# EAGLE design eTapper1main54 (EAGLE 8.6.0)
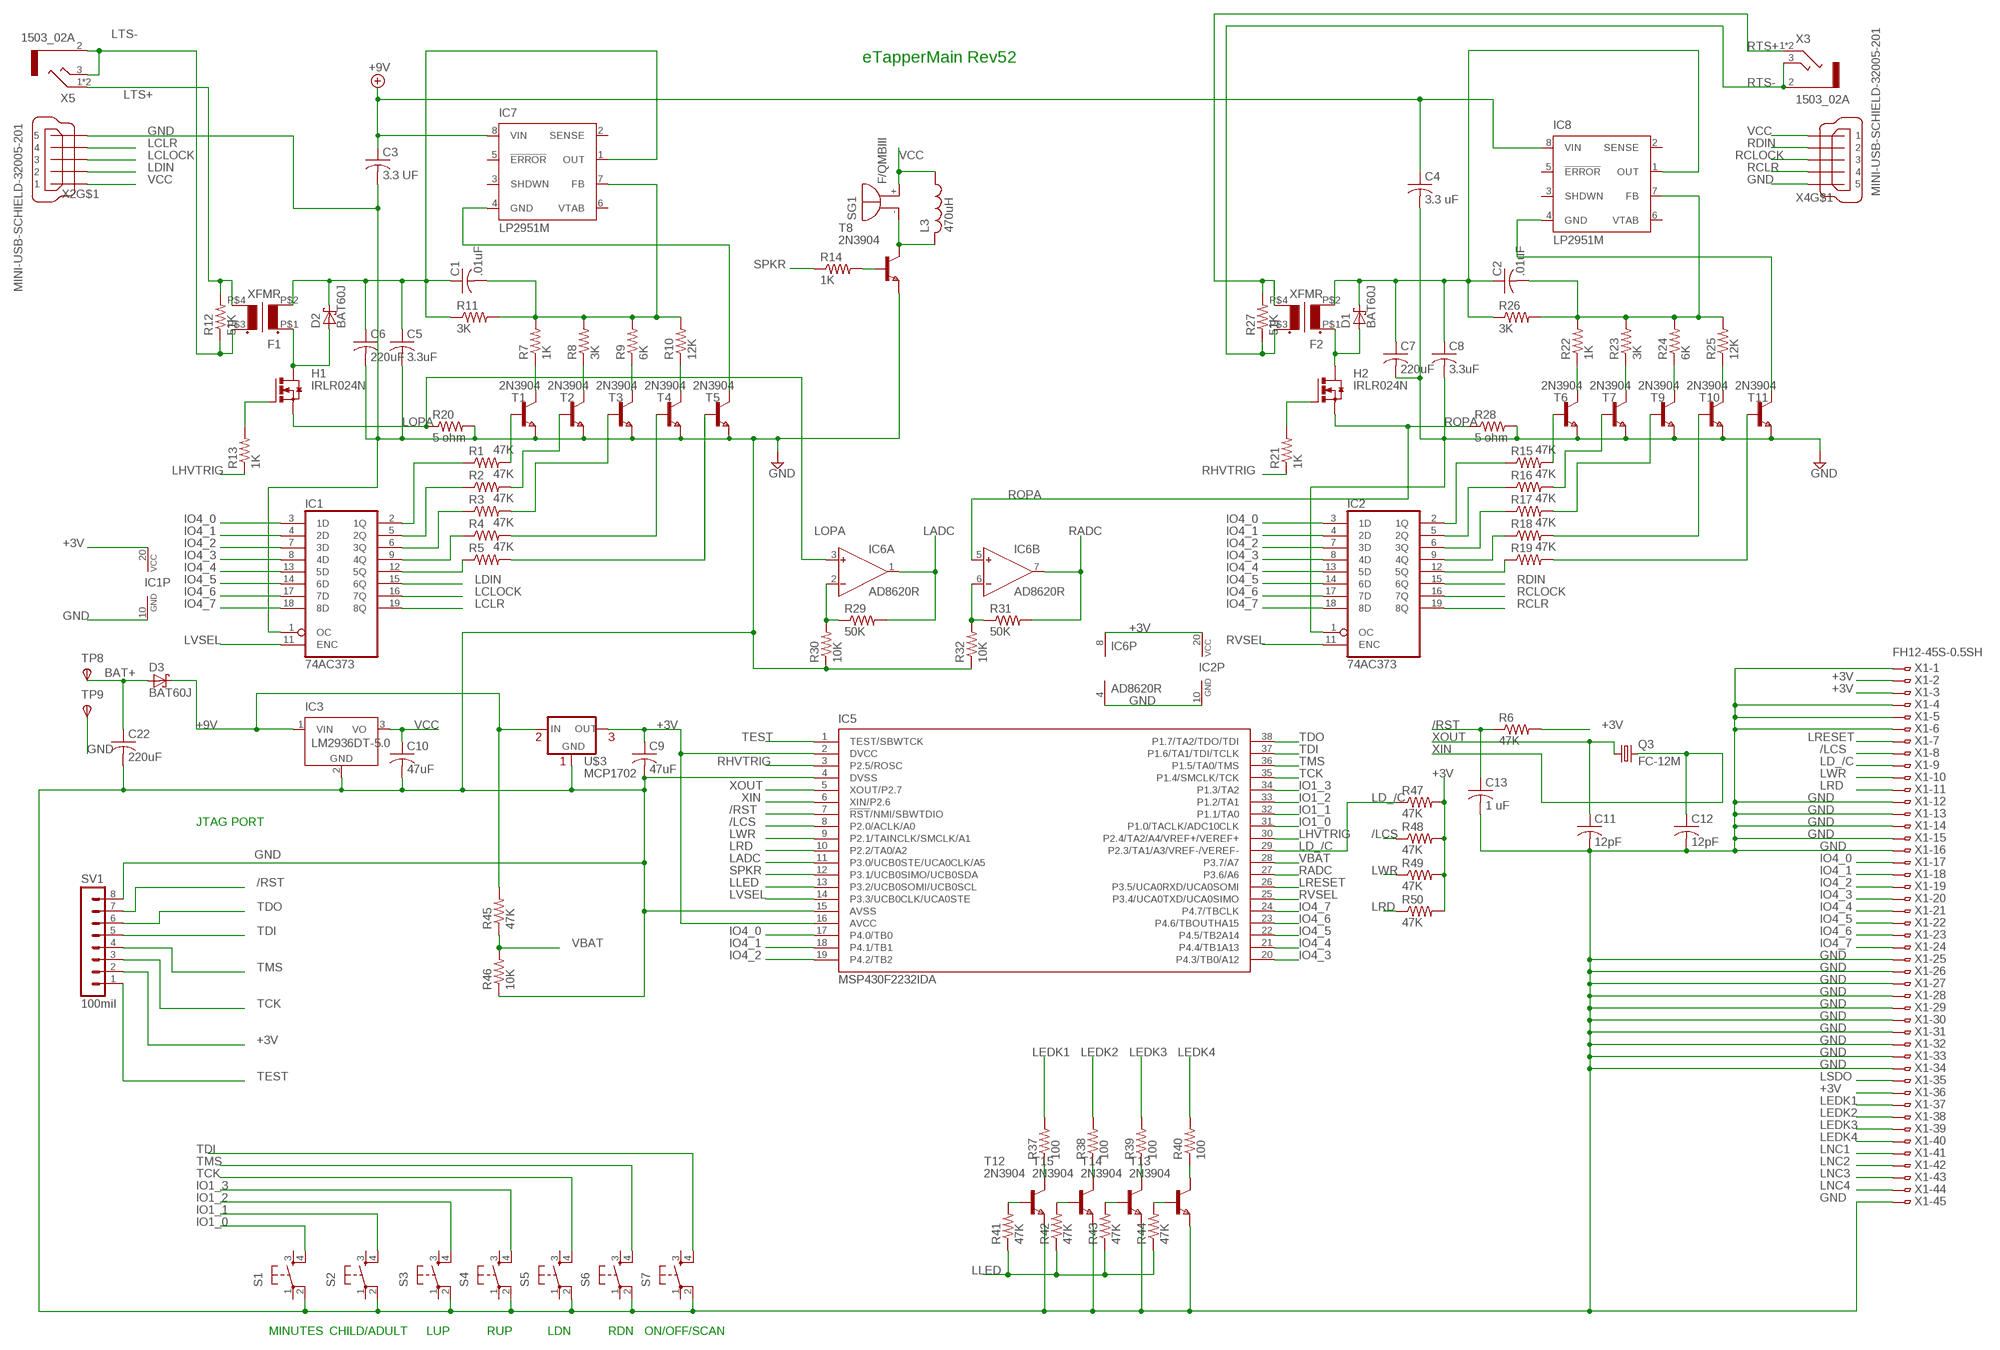
[diagram p0: schematic, sheet 1]

## Parts
C1  .01uF  C-USC0805  [C0805]
C2  .01uF  C-USC0805  [C0805]
C3  3.3 UF  C-USC1206  [C1206]
C4  3.3 uF  C-USC1206  [C1206]
C5  3.3uF  C-USC0805  [C0805]
C6  220uF  C-USC1206  [C1206]
C7  220uF  C-USC1206  [C1206]
C8  3.3uF  C-USC0805  [C0805]
C9  47uF  C-USC1206  [C1206]
C10  47uF  C-USC1206  [C1206]
C11  12pF  C-USC0805  [C0805]
C12  12pF  C-USC0805  [C0805]
C13  1 uF  C-USC0805  [C0805]
C22  220uF  C-USC1206  [C1206]
D1  BAT60J  [SOD323_ST]
D2  BAT60J  [SOD323_ST]
D3  BAT60J  [SOD323_ST]
F1  XFMR  [XFMR]
F2  XFMR  [XFMR]
H1  IRLR024N  [D-PAK_TO252AA]
H2  IRLR024N  [D-PAK_TO252AA]
IC1  74AC373  [SO20]
IC2  74AC373  [SO20]
IC3  LM2936DT-5.0  [TO252]
IC5  MSP430F2232IDA  [TSSOP38_R-PDSO-G38-DA]
IC6  AD8620R  [SO8]
IC7  LP2951M  [SO08]
IC8  LP2951M  [SO08]
L3  470uH  L-USL2825P  [L2825P]
Q3  FC-12M  [FC-12M]
R1  47K  R-US_R0603  [R0603]
R2  47K  R-US_R0603  [R0603]
R3  47K  R-US_R0603  [R0603]
R4  47K  R-US_R0603  [R0603]
R5  47K  R-US_R0603  [R0603]
R6  47K  R-US_R0603  [R0603]
R7  1K  R-US_R0603  [R0603]
R8  3K  R-US_R0603  [R0603]
R9  6K  R-US_R0603  [R0603]
R10  12K  R-US_R0603  [R0603]
R11  3K  R-US_R0603  [R0603]
R12  51K  R-US_R0603  [R0603]
R13  1K  R-US_R0603  [R0603]
R14  1K  R-US_R0603  [R0603]
R15  47K  R-US_R0603  [R0603]
R16  47K  R-US_R0603  [R0603]
R17  47K  R-US_R0603  [R0603]
R18  47K  R-US_R0603  [R0603]
R19  47K  R-US_R0603  [R0603]
R20  5 ohm  R-US_R0603  [R0603]
R21  1K  R-US_R0603  [R0603]
R22  1K  R-US_R0603  [R0603]
R23  3K  R-US_R0603  [R0603]
R24  6K  R-US_R0603  [R0603]
R25  12K  R-US_R0603  [R0603]
R26  3K  R-US_R0603  [R0603]
R27  51K  R-US_R0603  [R0603]
R28  5 ohm  R-US_R0603  [R0603]
R29  50K  R-US_R0603  [R0603]
R30  10K  R-US_R0603  [R0603]
R31  50K  R-US_R0603  [R0603]
R32  10K  R-US_R0603  [R0603]
R37  100  R-US_R0603  [R0603]
R38  100  R-US_R0603  [R0603]
R39  100  R-US_R0603  [R0603]
R40  100  R-US_R0603  [R0603]
R41  47K  R-US_R0603  [R0603]
R42  47K  R-US_R0603  [R0603]
R43  47K  R-US_R0603  [R0603]
R44  47K  R-US_R0603  [R0603]
R45  47K  R-US_R0603  [R0603]
R46  10K  R-US_R0603  [R0603]
R47  47K  R-US_R0603  [R0603]
R48  47K  R-US_R0603  [R0603]
R49  47K  R-US_R0603  [R0603]
R50  47K  R-US_R0603  [R0603]
S1  10-XX  [B3F-10XX]
S2  10-XX  [B3F-10XX]
S3  10-XX  [B3F-10XX]
S4  10-XX  [B3F-10XX]
S5  10-XX  [B3F-10XX]
S6  10-XX  [B3F-10XX]
S7  10-XX  [B3F-10XX]
SG1  F/QMBIII  [F/QMBIII]
SV1  100mil  MA08-1  [MA08-1]
T1  2N3904  NPNSOT23  [SOT-23]
T2  2N3904  NPNSOT23  [SOT-23]
T3  2N3904  NPNSOT23  [SOT-23]
T4  2N3904  NPNSOT23  [SOT-23]
T5  2N3904  NPNSOT23  [SOT-23]
T6  2N3904  NPNSOT23  [SOT-23]
T7  2N3904  NPNSOT23  [SOT-23]
T8  2N3904  NPNSOT23  [SOT-23]
T9  2N3904  NPNSOT23  [SOT-23]
T10  2N3904  NPNSOT23  [SOT-23]
T11  2N3904  NPNSOT23  [SOT-23]
T12  2N3904  NPNSOT23  [SOT-23]
T13  2N3904  NPNSOT23  [SOT-23]
T14  2N3904  NPNSOT23  [SOT-23]
T15  2N3904  NPNSOT23  [SOT-23]
TP8  TPSPAD1-20  [P1-20]
TP9  TPSPAD1-20  [P1-20]
U$3  MCP1702  [TO92-]
X1  FH12-45S-0.5SH  [FH12-45S-0.5SH]
X2  MINI-USB-SCHIELD-32005-201  [32005-201]
X3  1503_02A  [1503_02]
X4  MINI-USB-SCHIELD-32005-201  [32005-201]
X5  1503_02A  [1503_02]

## Nets
+3V [+3V]: C9.1 IC1.20(VCC) IC2.20(VCC) IC5.2(DVCC) IC5.16(AVCC) IC6.8(P:V+) R6.2 R47.2 R48.2 R49.2 R50.2 SV1.2 U$3.3(OUT) X1.2 X1.3 X1.36
+9V [+9V]: C3.1 C4.1 D3.C IC3.1(VIN) IC7.8(VIN) IC8.8(VIN) R45.2 U$3.2(IN)
/LCS: IC5.8(P2.0/ACLK/A0) R48.1 X1.8
/RST: C13.1 IC5.7(!RST!/NMI/SBWTDIO) R6.1 SV1.7
BAT+ [BAT+]: C22.1 D3.A TP8.TP(PP)
GND [GND]: C3.2 C4.2 C5.2 C6.2 C7.2 C8.2 C9.2 C10.2 C11.2 C12.2 C13.2 C22.2 IC1.1(OC) IC1.10(GND) IC2.1(OC) IC2.10(GND) IC3.2(GND) IC5.4(DVSS) IC5.15(AVSS) IC6.4(P:V-) R20.2 R28.2 R30.1 R32.1 R46.1 S1.2(P1) S2.2(P1) S3.2(P1) S4.2(P1) S5.2(P1) S6.2(P1) S7.2(P1) SV1.8 T1.2(E) T2.2(E) T3.2(E) T4.2(E) T5.2(E) T6.2(E) T7.2(E) T8.2(E) T9.2(E) T10.2(E) T11.2(E) T12.2(E) T13.2(E) T14.2(E) T15.2(E) TP9.TP(PP) U$3.1(GND) X1.1 X1.4 X1.5 X1.6 X1.12 X1.13 X1.14 X1.15 X1.16 X1.25 X1.26 X1.27 X1.28 X1.29 X1.30 X1.31 X1.32 X1.33 X1.34 X1.45 X2.5 X4.5
IO1_0: IC5.31(P1.0/TACLK/ADC10CLK) S1.4(S1)
IO1_1: IC5.32(P1.1/TA0) S2.4(S1)
IO1_2: IC5.33(P1.2/TA1) S3.4(S1)
IO1_3: IC5.34(P1.3/TA2) S4.4(S1)
IO4_0: IC1.3(1D) IC2.3(1D) IC5.17(P4.0/TB0) X1.17
IO4_1: IC1.4(2D) IC2.4(2D) IC5.18(P4.1/TB1) X1.18
IO4_2: IC1.7(3D) IC2.7(3D) IC5.19(P4.2/TB2) X1.19
IO4_3: IC1.8(4D) IC2.8(4D) IC5.20(P4.3/TB0/A12) X1.20
IO4_4: IC1.13(5D) IC2.13(5D) IC5.21(P4.4/TB1A13) X1.21
IO4_5: IC1.14(6D) IC2.14(6D) IC5.22(P4.5/TB2A14) X1.22
IO4_6: IC1.17(7D) IC2.17(7D) IC5.23(P4.6/TBOUTHA15) X1.23
IO4_7: IC1.18(8D) IC2.18(8D) IC5.24(P4.7/TBCLK) X1.24
LADC: IC5.11(P3.0/UCB0STE/UCA0CLK/A5) IC6.1(A:OUT) R29.2
LCLOCK: IC1.16(7Q) X2.3
LCLR: IC1.19(8Q) X2.4
LD_/C: IC5.29(P2.3/TA1/A3/VREF-/VEREF-) R47.1 X1.9
LDIN: IC1.15(6Q) X2.2
LEDK1: R37.2 X1.37
LEDK2: R38.2 X1.38
LEDK3: R39.2 X1.39
LEDK4: R40.2 X1.40
LHVTRIG: IC5.30(P2.4/TA2/A4/VREF+/VEREF+) R13.1
LLED: IC5.13(P3.2/UCB0SOMI/UCB0SCL) R41.1 R42.1 R43.1 R44.1
LNC1: X1.41
LNC2: X1.42
LNC3: X1.43
LNC4: X1.44
LOPA: H1.3(S) IC6.3(A:IN+) R20.1
LRD: IC5.10(P2.2/TA0/A2) R50.1 X1.11
LRESET: IC5.26(P3.5/UCA0RXD/UCA0SOMI) X1.7
LSDO: X1.35
LTS+: F1.P$4(S2) R12.2 X5.1 X5.4
LTS-: F1.P$3(S1) R12.1 X5.2 X5.3
LVSEL: IC1.11(ENC) IC5.14(P3.3/UCB0CLK/UCA0STE)
LWR: IC5.9(P2.1/TAINCLK/SMCLK/A1) R49.1 X1.10
N$1: IC1.2(1Q) R1.1
N$2: IC1.5(2Q) R2.1
N$3: IC1.6(3Q) R3.1
N$4: IC1.9(4Q) R4.1
N$5: IC1.12(5Q) R5.1
N$6: L3.2 SG1.-(+) T8.1(C)
N$7: R4.2 T4.3(B)
N$8: R5.2 T5.3(B)
N$9: D2.A F1.P$1(P1) H1.4(D)
N$10: R7.1 T1.1(C)
N$11: R8.1 T2.1(C)
N$12: R9.1 T3.1(C)
N$13: R1.2 T1.3(B)
N$14: R2.2 T2.3(B)
N$15: R3.2 T3.3(B)
N$16: R10.1 T4.1(C)
N$17: C1.2 IC7.7(FB) R7.2 R8.2 R9.2 R10.2 R11.2
N$18: C1.1 C5.1 C6.1 D2.C F1.P$2(P2) IC7.1(OUT) R11.1
N$19: D1.A F2.P$1(P1) H2.4(D)
N$20: IC2.2(1Q) R15.1
N$21: H1.1(G) R13.2
N$22: R14.2 T8.3(B)
N$24: IC2.5(2Q) R16.1
N$25: IC2.6(3Q) R17.1
N$26: IC2.9(4Q) R18.1
N$27: IC2.12(5Q) R19.1
N$28: R44.2 T13.3(B)
N$29: R15.2 T6.3(B)
N$30: R16.2 T7.3(B)
N$31: R17.2 T9.3(B)
N$32: R18.2 T10.3(B)
N$33: R19.2 T11.3(B)
N$35: R22.1 T6.1(C)
N$36: R23.1 T7.1(C)
N$37: R24.1 T9.1(C)
N$38: R25.1 T10.1(C)
N$39: C2.2 IC8.7(FB) R22.2 R23.2 R24.2 R25.2 R26.2
N$40: C2.1 C7.1 C8.1 D1.C F2.P$2(P2) IC8.1(OUT) R26.1
N$41: R37.1 T12.1(C)
N$42: H2.1(G) R21.2
N$43: R38.1 T15.1(C)
N$44: R39.1 T14.1(C)
N$45: IC7.4(GND) T5.1(C)
N$46: R40.1 T13.1(C)
N$47: IC8.4(GND) T11.1(C)
N$48: R43.2 T14.3(B)
N$49: R41.2 T12.3(B)
N$50: R42.2 T15.3(B)
N$52: IC6.6(B:IN-) R31.1 R32.2
N$54: IC6.2(A:IN-) R29.1 R30.2
RADC: IC5.27(P3.6/A6) IC6.7(B:OUT) R31.2
RCLOCK: IC2.16(7Q) X4.3
RCLR: IC2.19(8Q) X4.4
RDIN: IC2.15(6Q) X4.2
RHVTRIG: IC5.3(P2.5/ROSC) R21.1
ROPA: H2.3(S) IC6.5(B:IN+) R28.1
RTS+: F2.P$4(S2) R27.2 X3.1 X3.4
RTS-: F2.P$3(S1) R27.1 X3.2 X3.3
RVSEL: IC2.11(ENC) IC5.25(P3.4/UCA0TXD/UCA0SIMO)
SPKR: IC5.12(P3.1/UCB0SIMO/UCB0SDA) R14.1
TCK: IC5.35(P1.4/SMCLK/TCK) S5.4(S1) SV1.3
TDI: IC5.37(P1.6/TA1/TDI/TCLK) S7.4(S1) SV1.5
TDO: IC5.38(P1.7/TA2/TDO/TDI) SV1.6
TEST: IC5.1(TEST/SBWTCK) SV1.1
TMS: IC5.36(P1.5/TA0/TMS) S6.4(S1) SV1.4
VBAT: IC5.28(P3.7/A7) R45.1 R46.2
VCC [VCC]: C10.1 IC3.3(VO) L3.1 SG1.+(-) X2.1 X4.1
XIN: C12.1 IC5.6(XIN/P2.6) Q3.2
XOUT: C11.1 IC5.5(XOUT/P2.7) Q3.1
Unconnected: IC7.2(SENSE) IC7.3(SHDWN) IC7.5(!ERROR) IC7.6(VTAB) IC8.2(SENSE) IC8.3(SHDWN) IC8.5(!ERROR) IC8.6(VTAB) S1.1(P) S1.3(S) S2.1(P) S2.3(S) S3.1(P) S3.3(S) S4.1(P) S4.3(S) S5.1(P) S5.3(S) S6.1(P) S6.3(S) S7.1(P) S7.3(S) X2.M1(S:S1) X2.M2(S:S2) X2.M3(S:S3) X2.M4(S:S4) X4.M1(S:S1) X4.M2(S:S2) X4.M3(S:S3) X4.M4(S:S4)

## Notes on the sheet
- eTapperMain Rev52
- JTAG PORT
- MINUTES | CHILD/ADULT | LUP | RUP | LDN | RDN | ON/OFF/SCAN

## Library data of the parts
C1-C13 C22 = rcl:C-US: CAPACITOR, American symbol; SPICEPREFIX: C
D1-D3 = diode:BAT60J: Schottky barrier diode Source: www.st.com, BAT60J.pdf
F1 F2 = XFMR1:XFMR: Transformer 1"X1" 0.4"X0.4" hole separation for e_tapper
H1 H2 = IRLR024N:IRLR024N: IRLR024N HEXFET Power Mosfet N channel Infeneon Technology TO-251AA IPAK
IC1 IC2 = 74373_SO20:74*373: Octal D type transparent LATCH, edge triggered
IC3 = national-semiconductor:LM2936?*: Ultra-Low Quiescent Current LDO Voltage Regulator Source: Data sheet <http://www.national.com/ds/LM/LM2936.pdf>; MF: NATIONAL SEMICONDUCTOR; MPN: LM2936DT-5.0/NOPB; OC_FARNELL: 1286864; OC_NEWARK: 41K4501
IC5 = texas:MSP430F22*2IDA: MIXED SIGNAL MICROCONTROLLER Source: http://focus.ti.com/lit/ds/symlink/msp430f2274.pdf; MPN: MSP430F2232IDA; OC_FARNELL: 1610178; OC_NEWARK: 28M6312
IC6 = analog-devices:AD8620: Precision, Very Low Noise, Low Input Bias Current, Wide Bandwidth JFET Operational Amplifiers Source: http://www.analog.com/static/imported-files/data_sheets/AD8610_8620.pdf; MF: ALTERA CORPORATION; MPN: AD8620ARZ; OC_FARNELL: 9994386; OC_NEWARK: 59K6972
IC7 IC8 = national-semiconductor:LP2951: Adjustable Micropower Voltage Regulator Source: http://www.national.com/ds/LP/LP2950.pdf; MF: FAIRCHILD SEMICONDUCTOR; MPN: LP2951CM; OC_FARNELL: 9488561; OC_NEWARK: 78K6014
L3 = rcl:L-US: INDUCTOR, American symbol; SPICEPREFIX: L
Q3 = crystal:FC-12M: kHz RANGE CRYSTAL UNIT LOW PROFILE SMD Source: Epson Toyocom FC-12M.pdf
R1-R32 R37-R50 = resistor:R-US_: RESISTOR, American symbol
S1-S7 = switch-omron:10-XX: OMRON SWITCH; MPN: B3F-1000; OC_FARNELL: 176432; OC_NEWARK: 36M3542
SG1 = buzzer:F/QMBIII: BUZZER Source: Buerklin; OC_FARNELL: unknown; OC_NEWARK: unknown
SV1 = con-lstb:MA08-1: PIN HEADER; OC_FARNELL: unknown; OC_NEWARK: unknown
T1-T15 = zetex:NPNSOT23: NPN TRANSISTOR; MPN: DSS20201L-7; OC_FARNELL: 1710688; OC_NEWARK: 25R4555
TP8 TP9 = testpad:TPS: TEST PIN
U$3 = mcp1702:MCP1702: MCP1702 LDO Fixed Voltage regulator
X1 = con-hirose:FH12-45S-0.5S: 0.5mm Pitch Connectors For FPC/FFC Source: Data sheet <http://www.hirose.co.jp/cataloge_hp/e58605370.pdf>; OC_FARNELL: unknown; OC_NEWARK: unknown
X2 X4 = con-cypressindustries:MINI-USB-SCHIELD-: MINI USB-B Conector Source: www.cypressindustries.com; OC_FARNELL: unknown; OC_NEWARK: unknown
X3 X5 = 1503_02Astereojacks:1503_02A

## Module LP2951
Ports: 

### Library data of the parts

## Net classes
1 GND: width 0.305 mm, clearance 0.152 mm
2 BAT+: width 0.305 mm, clearance 0.152 mm
3 +9V: width 0.305 mm, clearance 0.152 mm
4 +3V: width 0.305 mm, clearance 0.152 mm
5 VCC: width 0.305 mm, clearance 0.152 mm

## Board
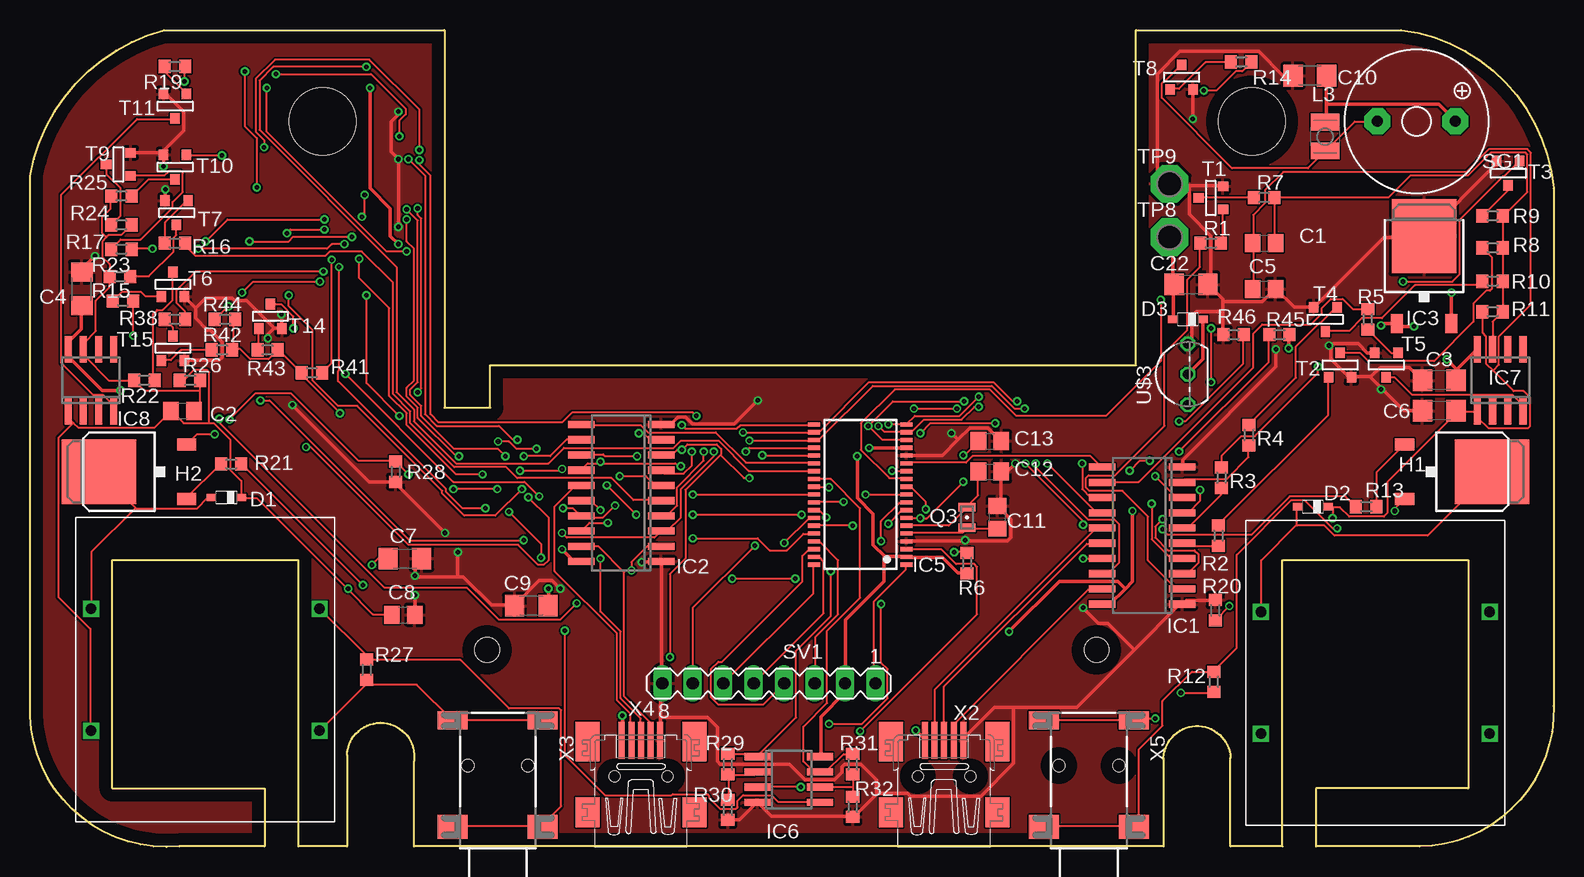
[diagram p1: board, top side]
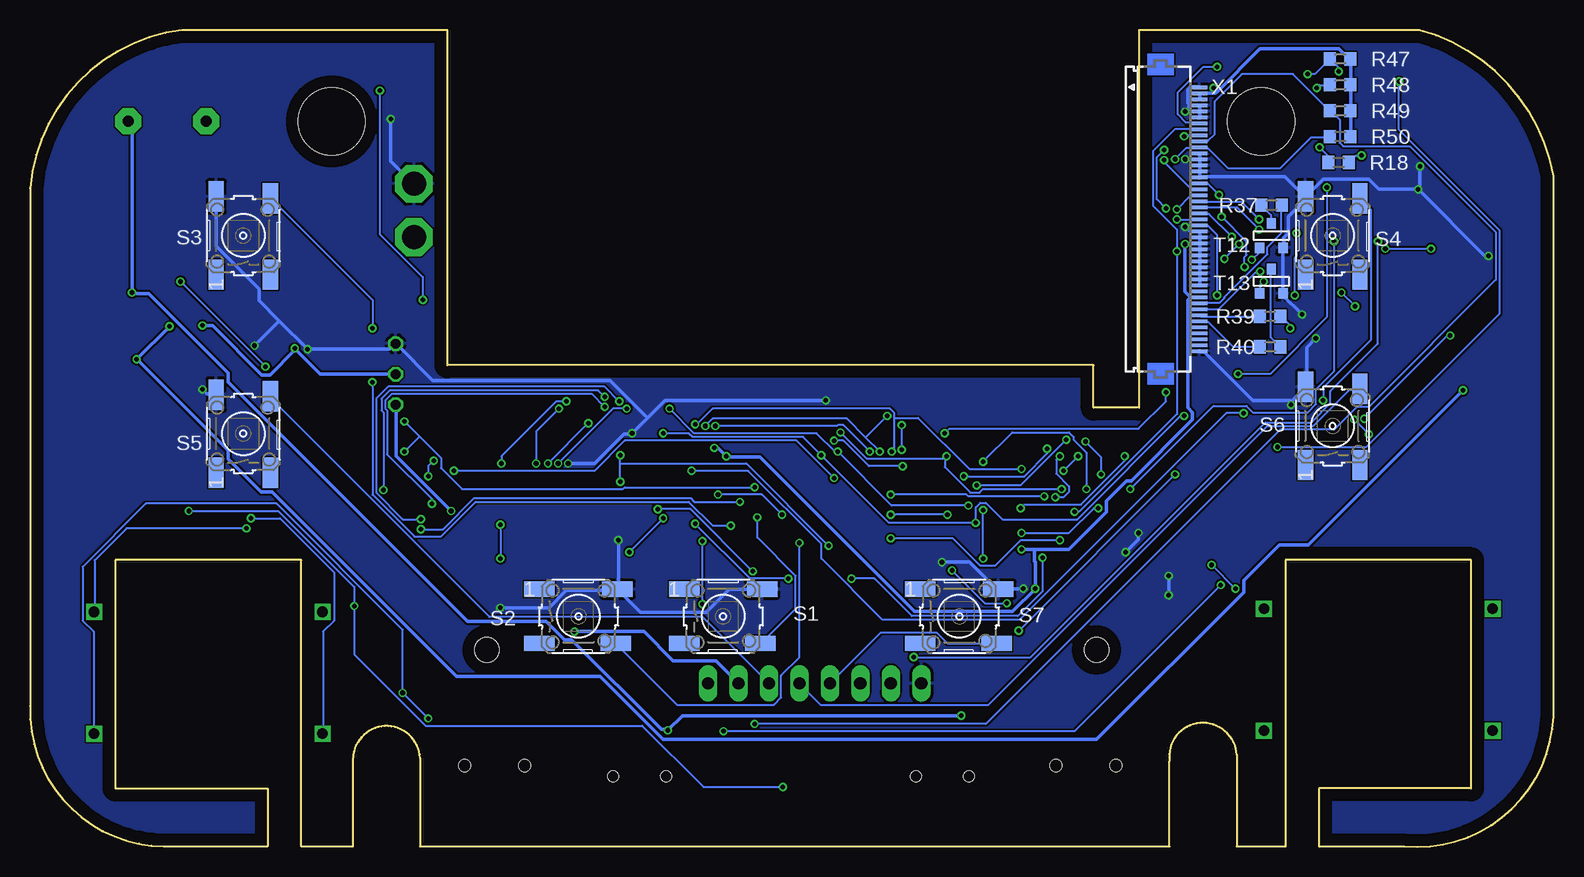
[diagram p2: board, bottom side, seen from below]

Size 127 x 68.12 mm. Coordinates in mm from the lower left corner, seen from the top.
Outline: 104.4,23.93 119.89,23.93 119.89,4.88 107.19,4.88 107.19,0.05 115.83,0.05 arc91 127,11.73 127,54.91 arc78 114.3,68.12 92.21,68.12 92.21,40.18 38.36,40.18 38.36,36.63 34.55,36.63 34.55,68.12 11.18,68.12 arc65 0,55.93 0,11.99 arc98 12.45,0.05 19.56,0.05 19.56,4.88 6.86,4.88 6.86,23.93 22.36,23.93 22.36,0.05 26.42,0.05 26.42,7.67 arc-185 32.01,7.16 32.01,0.05 94.49,0.05 94.49,7.42 arc-175 100.08,7.42 100.08,0.05 104.4,0.05 104.4,23.93
Copper layers (1*16): Top 0.035mm / dielectric 30mil / Bottom 0.035mm
Design rules "default *": minimum track width 6mil, minimum drill 15mil, track to track 6mil, track to pad 6mil, pad to pad 6mil, via to via 6mil, smd to smd 6mil, copper to edge 40mil, drill to drill 6mil, minimum pad ring 6mil, minimum via ring 6mil, stop-mask expansion 4mil, vias tented up to drill 0mil, thermal gap 10mil
Holes 5.59 mm at 24.39,60.5 101.86,60.5
Holes 2.03 mm at 38.1,16.43 88.9,16.43

### Footprints (pad centres in the part's own frame; a part is rotated, then mirrored left to right if it is on the bottom)
C0805 = smd 1.3 x 1.5: 1 -0.95,0; 2 0.95,0
C1206 = smd 1.6 x 1.8: 1 -1.4,0; 2 1.4,0
SOD323_ST = smd 0.8 x 0.6: A 1.25,0; C -1.25,0
XFMR = drill 0.889 square: P$1 -10.16,5.08; P$2 -10.16,-5.08; P$3 8.89,5.08; P$4 8.89,-5.08
D-PAK_TO252AA = smd 1 x 1.6: 1 -2.28,-4.8; 3 2.28,-4.8 | smd 5.4 x 6.2: 4 0,2.5
SO20 = smd 0.6 x 2.2: 1 -5.715,-3.33; 2 -4.445,-3.33; 3 -3.175,-3.33; 4 -1.905,-3.33; 5 -0.635,-3.33; 6 0.635,-3.33; 7 1.905,-3.33; 8 3.175,-3.33; 9 4.445,-3.33; 10 5.715,-3.33; 11 5.715,3.33; 12 4.445,3.33; 13 3.175,3.33; 14 1.905,3.33; 15 0.635,3.33; 16 -0.635,3.33; 17 -1.905,3.33; 18 -3.175,3.33; 19 -4.445,3.33; 20 -5.715,3.33
TO252 = smd 1 x 1.6: 1 -2.28,-4.8; 3 2.28,-4.8 | smd 5.4 x 6.2: 2 0,2.5
TSSOP38_R-PDSO-G38-DA = smd 0.35 x 1: 1 -5.85,-3.85; 2 -5.2,-3.85; 3 -4.55,-3.85; 4 -3.9,-3.85; 5 -3.25,-3.85; 6 -2.6,-3.85; 7 -1.95,-3.85; 8 -1.3,-3.85; 9 -0.65,-3.85; 10 0,-3.85; 11 0.65,-3.85; 12 1.3,-3.85; 13 1.95,-3.85; 14 2.6,-3.85; 15 3.25,-3.85; 16 3.9,-3.85; 17 4.55,-3.85; 18 5.2,-3.85; 19 5.85,-3.85; 20 5.85,3.85; 21 5.2,3.85; 22 4.55,3.85; 23 3.9,3.85; 24 3.25,3.85; 25 2.6,3.85; 26 1.95,3.85; 27 1.3,3.85; 28 0.65,3.85; 29 0,3.85; 30 -0.65,3.85; 31 -1.3,3.85; 32 -1.95,3.85; 33 -2.6,3.85; 34 -3.25,3.85; 35 -3.9,3.85; 36 -4.55,3.85; 37 -5.2,3.85; 38 -5.85,3.85
SO8 = smd 0.6 x 2.2: 1 -1.905,-2.6; 2 -0.635,-2.6; 3 0.635,-2.6; 4 1.905,-2.6; 5 1.905,2.6; 6 0.635,2.6; 7 -0.635,2.6; 8 -1.905,2.6
SO08 = smd 0.6 x 2.2: 1 -1.905,-2.6; 2 -0.635,-2.6; 3 0.635,-2.6; 4 1.905,-2.6; 5 1.905,2.6; 6 0.635,2.6; 7 -0.635,2.6; 8 -1.905,2.6
L2825P = smd 1.4 x 2.4: 1 -1.2,0; 2 1.2,0
FC-12M = smd 0.7 x 1.4: 1 -0.85,0; 2 0.85,0
R0603 = smd 1 x 1.1: 1 -0.85,0; 2 0.85,0
B3F-10XX = smd 2.54 x 1.27: 1 -3.251,2.261; 2 3.251,2.261; 3 -3.251,-2.261; 4 3.099,-2.261
F/QMBIII = drill 0.914 pad 2.159 octagon: + 3.251,0; - -3.251,0
MA08-1 = drill 1.016 long: 1 -8.89,0; 2 -6.35,0; 3 -3.81,0; 4 -1.27,0; 5 1.27,0; 6 3.81,0; 7 6.35,0; 8 8.89,0
SOT-23 = smd 0.787 x 0.889: 1 0.025,-1.016; 2 -0.94,1.016; 3 0.991,1.016
P1-20 = drill 2.007 pad 3.15 octagon: TP 0,0
TO92- = drill 0.813 octagon: 1 -1.27,1.27; 2 1.27,1.27; 3 3.81,1.27
FH12-45S-0.5SH = smd 0.3 x 1.3: 1 -13,3.25; 2 -12.5,3.25; 3 -12,3.25; 4 -11.5,3.25; 5 -11,3.25; 6 -10.5,3.25; 7 -10,3.25; 8 -9.5,3.25; 9 -9,3.25; 10 -8.5,3.25; 11 -8,3.25; 12 -7.5,3.25; 13 -7,3.25; 14 -6.5,3.25; 15 -6,3.25; 16 -5.5,3.25; 17 -5,3.25; 18 -4.5,3.25; 19 -4,3.25; 20 -3.5,3.25; 21 -3,3.25; 22 -2.5,3.25; 23 -2,3.25; 24 -1.5,3.25; 25 -1,3.25; 26 -0.5,3.25; 27 0,3.25; 28 0.5,3.25; 29 1,3.25; 30 1.5,3.25; 31 2,3.25; 32 2.5,3.25; 33 3,3.25; 34 3.5,3.25; 35 4,3.25; 36 4.5,3.25; 37 5,3.25; 38 5.5,3.25; 39 6,3.25; 40 6.5,3.25; 41 7,3.25; 42 7.5,3.25; 43 8,3.25; 44 8.5,3.25; 45 9,3.25
32005-201 = smd 3.1 x 0.5: 1 3,1.6; 2 3,0.8; 3 3,0; 4 3,-0.8; 5 3,-1.6 | smd 2.5 x 2: M1 -3,-4.45; M2 -3,4.45 | smd 3.3 x 2: M3 2.9,4.45; M4 2.9,-4.45 | hole 0.9: 0,2.2; 0,-2.2
1503_02 = smd 2.5 x 1.5: 1 -3.75,-10.75; 4 3.75,-10.75 | smd 2.5 x 2: 2 -3.75,-1.9; 3 3.75,-1.9 | hole 1: -2.5,-7; 2.5,-7

### Placement (x,y rotation side)
C1  102.87,50.34 0 top
C2  12.7,36.37 0 top
C3  117.48,38.91 180 top
C4  4.32,46.53 90 top
C5  102.87,46.53 0 top
C6  117.48,36.37 180 top
C7  31.25,24.05 0 top
C8  31.12,19.35 0 top
C9  41.79,20.12 180 top
C10  106.68,64.31 180 top
C11  80.65,27.48 90 top
C12  80.01,31.29 0 top
C13  80.01,33.83 0 top
C22  96.78,46.91 0 top
D1  16.39,29.13 180 top
D2  106.94,28.37 180 top
D3  96.52,43.99 180 top
DRILEGEND  [DRILEGEND]  -4.57,-8.42 0 top  (outside the outline)
F1  112.78,14.53 0 top
F2  15.24,14.78 0 top
H1  119.38,31.29 270 top
H2  8.26,31.29 90 top
IC1  92.71,25.96 90 top
IC2  49.28,29.51 90 top
IC3  116.21,48.44 0 top
IC5  69.22,29.39 90 top
IC6  63.25,5.64 270 top
IC7  122.56,38.91 0 top
IC8  5.08,38.91 0 top
L3  107.95,59.23 270 top
Q3  78.11,27.48 90 top
R1  98.43,50.34 0 top
R2  99.06,25.96 90 top
R3  99.32,30.78 90 top
R4  101.6,34.34 90 top
R5  111.51,43.99 270 top
R6  78.11,23.67 270 top
R7  102.87,54.15 0 top
R8  121.92,49.96 0 top
R9  121.92,52.63 0 top
R10  121.92,47.17 0 top
R11  121.92,44.63 0 top
R12  98.68,13.77 270 top
R13  111.38,28.37 0 top
R14  100.97,65.45 180 top
R15  7.75,45.52 180 top
R16  12.07,50.34 180 top
R17  7.62,49.83 180 top
R18  17.91,57.07 0 bottom
R19  12.07,65.07 180 top
R20  98.81,19.73 90 top
R21  16.77,31.93 180 top
R22  9.53,38.91 180 top
R23  7.5,47.55 180 top
R24  7.62,51.87 0 top
R25  7.62,54.28 180 top
R26  13.34,38.91 0 top
R27  28.07,14.78 270 top
R28  30.48,31.29 270 top
R29  58.17,6.91 90 top
R30  58.17,3.1 90 top
R31  68.58,6.91 90 top
R32  68.58,3.35 90 top
R37  23.5,53.52 0 bottom
R38  12.07,43.99 0 top
R39  23.63,44.25 180 bottom
R40  23.63,41.71 180 bottom
R41  23.5,39.55 0 top
R42  16.01,41.45 180 top
R43  19.82,41.45 180 top
R44  16.26,43.99 180 top
R45  104.14,42.72 0 top
R46  100.33,42.72 0 top
R47  17.78,65.71 0 bottom
R48  17.78,63.55 0 bottom
R49  17.78,61.39 0 bottom
R50  17.78,59.23 0 bottom
S1  69.22,19.23 0 bottom
S2  81.28,19.23 0 bottom
S3  109.22,50.98 90 bottom
S4  18.42,50.98 90 bottom
S5  109.22,34.47 90 bottom
S6  18.42,35.1 90 bottom
S7  49.53,19.23 0 bottom
SG1  115.57,60.5 0 top
SV1  61.6,13.64 180 top
T1  98.43,54.15 270 top
T2  109.22,40.18 180 top
T3  123.19,56.18 0 top
T4  107.95,43.99 0 top
T5  113.03,40.18 0 top
T6  11.94,46.91 180 top
T7  12.2,52.88 0 top
T8  96.02,64.18 180 top
T9  7.37,56.95 270 top
T10  12.07,56.69 0 top
T11  12.07,61.77 0 top
T12  23.5,50.98 180 bottom
T13  23.5,47.17 180 bottom
T14  20.07,44.25 180 top
T15  11.94,41.58 180 top
TP8  95,50.85 0 top
TP9  95,55.29 0 top
U$3  95.25,40.69 270 top
X1  32.77,50.34 270 bottom
X2  76.2,5.89 90 top
X3  38.99,-0.2 180 top
X4  50.93,5.89 90 top
X5  88.27,-0.2 180 top

### Tracks (layer width: path | path; a pad name or v marks a point on that pad's centre or on a via)
+3V  (via drill 0.38)
  Top 0.305: IC1.20 90,20.24 91.29,21.54 | 91.29,21.54 91.9,22.15 v91.9,28.01 | IC6.8 65.92,7.59 65.92,10.87 67.9,12.85 67.9,13.61 SV1.2 67.97,13.77 67.97,18.95 71.18,22.15 71.18,24.13 71.25,24.2 | R6.2 78.11,22.83 77.35,22.83 76.05,24.13 73.08,24.13 IC5.2 72.93,24.2 71.25,24.2 | v69.96,33.27 73,33.27 IC5.16 | v68.97,32.59 68.97,29.08 70.26,27.79 70.26,25.2 71.25,24.2 | 91.29,21.54 90.68,22.15 85.81,22.15 v81.61,17.96 | v44.35,24.81 45.34,23.82 45.88,23.82 IC2.20 | v43.21,21.54 43.21,20.17 C9.1 | v28.35,63.3 28.35,54.91 30.03,53.24 30.03,50.95 v30.71,50.27
  Bottom 0.305: v91.9,28.01 96.47,32.59 96.47,36.85 U$3.3 | v69.96,33.27 69.65,33.27 v68.97,32.59 68.89,32.51 66.15,32.51 53.27,19.63 45.11,19.63 v43.21,21.54 43.21,23.75 43.29,23.82 43.29,24.81 | v81.61,17.96 75.82,17.96 73.39,15.52 69.8,15.52 67.97,13.69 SV1.2 | R50.2 16.92,59.26 16.92,61.39 R49.2 16.92,61.47 16.92,63.45 R48.2 16.92,63.6 16.92,65.66 R47.2 17.07,65.73 17.91,66.57 24.46,66.57 28.05,62.99 | X1.3 29.49,62.38 29.49,62.84 X1.2 29.34,62.84 28.2,62.84 28.05,62.99 | 30.26,45.85 29.57,45.85 X1.36 | 30.26,45.85 30.48,45.62 30.48,36.63 30.1,36.24 30.1,35.63 35.21,30.53 35.59,30.53 37.27,28.85 37.27,27.94 40.39,24.81 43.29,24.81 | v44.35,24.81 43.29,24.81 | v28.35,63.3 28.05,62.99 | v30.71,50.27 30.71,46.3 30.26,45.85
+9V  (via drill 0.38)
  Top 0.305: C4.1 4.27,45.08 4.27,43.18 3.2,42.11 3.2,41.58 IC8.8 3.28,41.43 3.28,40.82 6.02,38.07 v7.55,38.07 | 118.95,39.83 118.95,38.91 C3.1 | 118.95,39.83 120.63,41.5 IC7.8 | U$3.2 97.77,40.66 97.77,43.94 D3.C | v104.93,41.58 104.93,42.72 R45.2 | v112.63,43.48 112.78,43.64 IC3.1 114.08,43.64 114.3,43.41 v115.37,43.41 | v118.11,40.66 118.95,39.83
  Bottom 0.305: U$3.2 96.55,39.44 102.8,39.44 v104.93,41.58 104.93,41.43 106.99,39.37 107.68,39.37 111.79,43.48 v112.63,43.48 | v115.37,43.41 v118.11,40.66 110.49,33.04 110.49,32.36 107.75,29.62 106.84,29.62 91.44,14.22 79.48,14.22 74.22,8.96 38.1,8.96 25.84,21.23 25.84,22.22 22.86,25.2 20.43,25.2 v7.55,38.07
/LCS  (via drill 0.38)
  Top 0.152: v71.56,26.95 72.62,28.01 73,28.01 IC5.8 | v58.53,22.38 v63.78,22.38 | v42.6,24.13 42.6,25.27 v39.93,27.94 | v19.74,63.3 19.74,59.64 29.72,49.66 v31.4,49.66
  Bottom 0.152: v71.56,26.95 66.98,22.38 v63.78,22.38 | v58.53,22.38 56.62,22.38 53.5,19.25 44.66,19.25 42.6,21.31 v42.6,24.13 | v39.93,27.94 39.55,27.94 31.4,36.09 v31.4,49.66 31.4,51.48 33.38,53.47 33.38,58.04 31.55,59.87 29.57,59.87 X1.8 | v19.74,63.3 19.51,63.52 18.67,63.52 R48.1
/RST  (via drill 0.38)
  Top 0.152: v77.04,24.59 78.11,24.59 R6.1 | IC5.7 73.08,27.41 v74.22,27.41 74.76,27.41 v77.8,30.45 | v77.8,32.66 77.88,32.66 79.02,33.81 C13.1 | SV1.7 55.25,19.94 v60.43,25.12
  Bottom 0.152: v77.04,24.59 v74.22,27.41 | v77.8,30.45 77.8,31.98 | 77.8,31.98 v77.8,32.66 | v60.43,25.12 67.29,31.98 77.8,31.98
BAT+
  Top 0.305: D3.A 95.33,44.02 95.33,46.91 C22.1 95.25,46.99 95.25,50.57 95.03,50.8 TP8.TP
GND  (via drill 0.38)
  Top 0.305: 77.96,25.5 81.46,25.5 81.77,25.81 81.77,27.33 80.7,28.4 C11.2 80.7,28.55 80.93,28.78 80.93,31.29 C12.2 81.08,31.37 81.54,31.37 v82.15,31.98 | 77.96,25.5 73.08,25.5 IC5.4 | v77.96,25.58 77.96,25.5 | 77.35,33.96 78.34,34.95 79.86,34.95 80.93,33.88 C13.2 | 77.35,33.96 76.05,32.66 73.08,32.66 IC5.15 | v60.66,37.24 58.68,35.25 55.25,35.25 54.64,35.86 54.03,35.86 53.42,35.25 52.66,35.25 IC2.10 | 77.35,33.96 v76.81,34.49 | 96.63,55.14 95.18,55.14 95.03,55.29 TP9.TP 94.87,55.37 93.96,56.29 93.96,64.44 95.86,66.34 102.42,66.34 104.4,64.36 105.24,64.36 C10.2 | 96.63,55.14 99.45,55.14 T1.2 | v96.93,60.7 96.93,63.14 T8.2 | T3.2 122.23,57.2 122.23,56.97 116.21,50.95 IC3.2 116.13,50.8 112.86,50.8 107.14,45.08 T4.2 105.39,45.01 103.87,46.53 C5.2 103.71,46.46 102.72,45.46 99.45,45.46 | 99.45,45.46 99.45,45.69 98.23,46.91 C22.2 98.3,46.99 98.45,47.14 98.45,50.95 96.63,52.78 96.63,55.14 | 99.45,45.46 99.45,44.63 | 99.45,44.63 99.45,42.72 R46.1 | 111.79,39.22 110.19,39.22 T2.2 110.04,39.22 109.88,39.22 108.44,40.66 108.44,41.73 | 111.79,39.22 112.55,39.98 114.99,39.98 116.06,38.91 C3.2 | T5.2 111.49,41.2 110.72,41.96 108.67,41.96 108.44,41.73 | 112.7,38.23 111.79,39.14 111.79,39.22 | 112.7,38.23 114.53,36.4 116.06,36.4 C6.2 | v112.63,38.15 112.7,38.23 | v103.87,41.5 103.87,40.05 96.09,32.28 96.09,31.67 IC1.10 | v108.28,41.81 108.36,41.81 108.44,41.73 | 99.45,44.63 97.24,44.63 96.85,44.25 96.85,42.26 96.55,41.96 U$3.1 | v21.87,36.85 28.27,30.45 30.48,30.45 R28.2 30.48,30.3 v34.6,26.19 | 13.8,44.93 13.8,44.09 14.79,43.1 15.02,43.1 16.01,42.11 16.01,40.82 15.78,40.59 12.88,40.59 T15.2
  Top 0.305: 13.8,44.93 12.88,45.85 T6.2 | 20.35,43.25 20.96,43.25 T14.2 20.96,43.41 v20.96,44.4 | 20.35,43.25 18.06,45.54 17.07,45.54 16.84,45.77 14.63,45.77 13.8,44.93 | T9.2 10.98,57.89 11.13,57.73 T10.2 | T11.2 11.13,62.76 11.36,62.76 12.81,61.31 12.81,59.71 11.05,57.96 T10.2 | v11.28,54.84 11.28,53.92 T7.2 | v5.41,49.27 4.35,48.21 4.35,47.98 C4.2 | v30.71,61.31 30.71,61.09 30.1,60.48 30.1,57.96 v30.71,57.35 v30.71,51.71 | v11.13,56.74 T10.2 | v19.82,42.42 19.82,42.72 20.35,43.25 | 52.58,10.79 52.58,13.61 SV1.8 52.66,13.69 52.66,23.75 IC2.1 52.51,23.75 v50.98,23.75 | 52.58,10.79 52.58,8.96 X4.5 | v32.08,21 32.08,19.4 C8.2 | C7.2 32.62,24.05 32.08,23.52 v32.08,22.6 32.16,22.53 35.67,22.53 | 35.67,22.53 36.12,22.53 38.49,20.17 40.31,20.17 C9.2 40.47,20.24 42.45,22.22 43.51,22.22 v44.2,21.54 | R30.1 58.22,2.26 59.14,2.26 60.58,3.71 IC6.4 60.74,3.63 61.8,2.56 68.58,2.56 R32.1 68.66,2.64 68.81,2.64 70.64,4.47 | R20.2 98.76,20.55 96.4,20.55 96.09,20.24 IC1.1 95.94,20.17 95.79,20.17 92.05,16.43 | 92.05,16.43 87.25,11.63 82,11.63 | 82,11.63 80.4,11.63 77.73,8.96 X2.5 | 70.64,4.47 73.16,4.47 73.39,4.24 79.25,4.24 82,6.98 82,11.63 | 52.58,10.79 56.47,10.79 57.31,9.96 57.31,7.14 57.54,6.91 63.33,6.91 64.62,5.61 67.06,5.61 67.67,6.22 67.67,6.68 67.9,6.91 69.27,6.91 70.57,5.61 70.57,4.55 70.64,4.47 | 35.67,22.53 v35.67,24.59 | v87.79,19.94 89.08,18.64 89.84,18.64 92.05,16.43
  Bottom 0.305: S1.2 65.99,21.46 68.74,21.46 70.64,19.56 76.13,19.56 78.03,21.46 S2.2 | v77.96,25.58 77.96,21.61 S2.2 | v60.66,37.24 74.07,37.24 75.52,35.79 | 75.52,35.79 v76.81,34.49 76.89,34.42 77.5,34.42 79.94,31.98 v82.15,31.98 | v96.93,60.7 96.93,57.2 95.03,55.29 TP9.TP | v112.63,38.15 112.25,37.77 111.49,37.77 S5.2 | S3.2 111.49,50.11 107.9,46.53 107.9,45.54 106.23,43.86 | 106.23,43.86 v103.87,41.5 97.01,41.5 96.55,41.96 U$3.1 96.4,41.88 93.43,38.91 78.64,38.91 75.52,35.79 | 106.23,43.86 v108.28,41.81 | 21.87,37.16 v21.87,36.85 | 21.87,37.16 S6.2 20.58,38.45 20.58,41.65 v19.82,42.42 | X1.45 29.49,41.27 29.11,41.27 25.07,37.24 21.95,37.24 21.87,37.16 | X1.34 29.49,46.91 29.49,47.29 X1.33 29.49,47.45 29.49,47.83 X1.32 29.49,47.98 29.49,48.28 X1.31 29.49,48.44 29.49,48.82 X1.30 29.49,48.97 29.49,49.27 X1.29 29.49,49.43 29.49,49.81 X1.28 29.49,49.96 29.49,50.34 X1.27 29.49,50.42 29.49,50.8 X1.26 29.49,50.95 29.49,51.33 X1.25 29.65,51.33 30.33,51.33 v30.71,51.71 | X1.6 29.49,60.86 29.49,61.31 X1.5 29.49,61.47 29.49,61.77 X1.4 29.65,61.85 30.33,61.85 | 30.33,61.85 30.48,62 30.48,63.14 30.26,63.37 29.57,63.37 X1.1 | X1.13 29.49,57.28 29.49,56.97 X1.14 29.49,56.82 29.49,56.44 X1.15 29.49,56.29 29.49,55.9 X1.16 29.34,55.9 22.41,55.9 20.81,54.3 S4.2 | X1.12 29.49,57.81 29.49,57.43 X1.13 | v11.28,54.84 14.56,54.84 15.4,55.68 19.21,55.68 20.65,54.23 S4.2 | v5.41,49.27 5.72,49.27 v11.28,54.84 | S4.2 20.81,54.15 20.81,53.85 22.1,52.55 22.1,51.18 22.48,50.8 22.48,50.04 T12.2 T13.2 22.64,46.07 v20.96,44.4 | v30.71,61.31 30.41,61.62 30.41,61.77 30.33,61.85 | v30.71,57.35 29.65,57.35 X1.13
  Bottom 0.305: v11.13,56.74 11.13,54.84 v11.28,54.84 | v32.08,22.6 v32.08,21 | v44.2,21.54 46.26,21.54 S7.2 46.41,21.46 48.7,23.75 v50.98,23.75 | v34.6,26.19 34.6,25.65 v35.67,24.59 | v87.79,19.94 83.75,19.94 82.3,21.39 78.11,21.39 S2.2
  pour Top: 0,68.63 127,68.63 127,0.05 0,0.05
  pour Bottom: 0,68.63 127,68.63 127,0.05 0,0.05
IO1_0  (via drill 0.38)
  Top 0.152: v66.37,27.48 65.84,28.01 65.38,28.01 IC5.31
  Bottom 0.152: v66.37,27.48 66.37,25.81 63.17,22.6 63.17,19.86 66.07,16.97 S1.4
IO1_1  (via drill 0.38)
  Top 0.152: v62.87,25.35 64.93,27.41 65.31,27.41 IC5.32
  Bottom 0.152: v62.87,25.35 62.87,15.82 64.39,14.3 64.39,12.47 65,11.86 73.08,11.86 S2.4
IO1_2  (via drill 0.38)
  Top 0.152: v68.58,26.8 IC5.33 | v98.45,43.25 v98.45,38.76
  Bottom 0.152: v68.58,26.8 70.11,26.8 72.09,28.78 89.84,28.78 92.74,25.88 94.95,25.88 98.45,29.39 v98.45,38.76 | v98.45,43.25 98.45,45.62 106.91,54.08 S3.4
IO1_3  (via drill 0.38)
  Top 0.152: v55.25,25.73 60.66,25.73 61.65,24.74 63.1,24.74 64.47,26.11 65.31,26.11 IC5.34 | v41.15,25.58 31.63,25.58 19.97,37.24 v19.21,37.24
  Bottom 0.152: v55.25,25.73 50.07,25.73 47.78,23.44 46.56,23.44 44.43,25.58 v41.15,25.58 | v19.21,37.24 19.21,38.3 15.24,42.26 15.24,53.16 S4.4
IO4_0  (via drill 0.38)
  Top 0.152: v57,32.97 57,32.59 54.26,29.84 54.26,27.48 53.12,26.34 IC2.3 52.58,26.34 52.05,25.81 44.73,25.81 v44.35,26.19 | IC5.17 73,33.96 71.02,33.96 v69.88,35.1 71.94,37.16 v77.88,37.16 | v27.89,54.38 27.89,52.78 v27.67,52.55 | v25.76,48.36 25.76,39.75 25.68,39.67 25.68,38.84 34.68,29.84 34.68,29.62 36.05,28.24 v37.95,28.24 | v94.42,27.33 93.81,26.72 93.81,25.81 94.87,24.74 97.08,24.74 97.39,24.43 97.39,23.67 96.55,22.83 96.09,22.83 IC1.3
  Bottom 0.152: v69.88,35.1 59.75,35.1 59.67,35.18 59.21,35.18 v57,32.97 | v27.89,54.38 28.81,55.29 29.49,55.29 X1.17 | v27.67,52.55 25.61,50.49 25.61,49.35 25.76,49.2 v25.76,48.36 | v37.95,28.24 38.33,28.24 40.39,26.19 v44.35,26.19 | v94.42,27.33 95.94,27.33 98.15,29.54 98.15,37.39 97.16,38.38 79.1,38.38 v77.88,37.16
IO4_1  (via drill 0.38)
  Top 0.152: v70.72,35.1 71.18,34.64 73,34.64 IC5.18 73.08,34.64 73.54,34.64 74.53,35.63 77.65,35.63 78.72,36.7 v79.1,36.7 | v56.16,32.97 56.16,32.21 53.95,30 53.95,28.47 53.12,27.63 52.66,27.63 IC2.4 | v32.47,57.28 32.47,56.89 33.38,55.98 33.38,36.09 34.07,35.41 44.35,35.41 45.19,36.24 55.25,36.24 v55.55,35.94 | IC1.4 95.1,24.05 93.5,25.65 v93.5,28.62
  Bottom 0.152: v70.72,35.1 70.11,35.71 58.91,35.71 57.34,34.15 | v56.16,32.97 57.34,34.15 | v32.47,57.28 32.47,57.12 30.26,54.91 29.57,54.91 X1.18 | 57.34,34.15 v55.55,35.94 | v93.5,28.62 93.5,29.01 97.24,32.74 97.24,36.4 97.39,36.55 97.39,37.24 96.85,37.77 80.17,37.77 v79.1,36.7
IO4_2  (via drill 0.38)
  Top 0.152: v71.56,35.25 73,35.25 IC5.19 73.08,35.25 73.77,35.94 77.5,35.94 v79.1,37.54 | v55.17,32.97 55.17,31.82 54.49,31.14 52.89,31.14 52.66,31.37 IC2.7 | v31.4,53.16 32.31,52.25 32.31,38.76 31.7,38.15 31.7,37.69 32.62,36.78 32.62,35.94 35.36,33.2 39.02,33.2 v39.63,32.59 | v40.85,31.37 44.2,31.37 v44.35,31.52 | IC1.7 96.55,27.86 97.54,28.85 v97.54,29.77
  Bottom 0.152: v71.56,35.25 71.4,35.25 70.11,36.55 55.33,36.55 54.94,36.17 54.94,35.79 | 54.94,35.79 54.94,33.2 v55.17,32.97 | v31.4,53.16 30.26,54.3 29.57,54.3 X1.19 | v40.85,31.37 v39.63,32.59 | v44.35,31.52 48.7,31.52 52.96,35.79 54.94,35.79 | v97.54,29.77 97.54,36.24 97.69,36.4 97.69,37.39 97.01,38.07 79.63,38.07 v79.1,37.54
IO4_3  (via drill 0.38)
  Top 0.152: v54.34,35.18 54.64,34.87 58.91,34.87 59.21,35.18 65.31,35.18 IC5.20 | IC2.8 52.66,32.74 53.57,32.74 53.95,33.12 v54.34,33.12 54.79,33.58 57.23,33.58 57.61,33.2 57.61,32.74 57.57,32.7 | v24.54,52.32 16.46,52.32 v14.63,50.49 | v53.34,15.82 53.34,22.76 54.64,24.05 54.64,29.77 57.57,32.7 | v93.81,30.91 95.56,29.16 96.02,29.16 IC1.8 | v93.35,32.21 92.51,32.21 v91.67,31.37 | v59.97,30.76 59.52,30.76 57.57,32.7
  Bottom 0.152: v54.34,33.12 v54.34,35.18 | v24.54,52.32 25.99,53.77 29.49,53.77 X1.20 | v14.63,50.49 14.63,41.96 18.6,38 18.6,37.01 20.2,35.41 24.01,35.41 43.59,15.82 v53.34,15.82 | v93.81,30.91 93.81,31.75 v93.35,32.21 | v91.67,31.37 79.94,31.37 77.42,33.88 63.1,33.88 v59.97,30.76
IO4_4  (via drill 0.38)
  Top 0.152: v59.44,34.57 65.31,34.57 IC5.21 65.38,34.64 65.84,34.64 69.96,38.76 80.32,38.76 81.92,37.16 v82.3,37.16 | v50.6,32.59 47.93,32.59 47.78,32.74 45.95,32.74 IC2.13 | v24.54,51.48 21.72,51.48 v21.42,51.18 | v21.57,46 21.57,45.08 23.55,43.1 23.55,38.91 25.68,36.78 27.28,36.78 34.37,29.69 34.37,29.46 36.2,27.63 38.79,27.63 v41,29.84 | v87.71,31.98 87.71,29.84 88.4,29.16 89.31,29.16 IC1.13
  Bottom 0.152: v59.44,34.57 57.23,32.36 50.83,32.36 v50.6,32.59 50.75,32.36 50.75,31.67 48.62,29.54 47.86,29.54 47.55,29.84 v41,29.84 | v24.54,51.48 26.37,53.31 29.49,53.31 X1.21 | v21.42,51.18 21.42,49.27 21.57,49.12 v21.57,46 | v87.71,31.98 87.71,32.59 83.14,37.16 v82.3,37.16
IO4_5  (via drill 0.38)
  Top 0.152: v59.97,33.88 65.31,33.88 IC5.22 65.38,33.96 65.77,33.96 70.26,38.45 80.17,38.45 82.07,36.55 v82.91,36.55 | v54.26,31.75 54.03,31.75 53.8,31.98 47.55,31.98 | 47.55,31.98 46.49,31.98 45.95,31.44 IC2.14 | v26.83,50.87 21.95,50.87 21.57,50.49 v18.29,50.49 | v38.94,29.84 v35.29,29.84 | 47.55,31.98 v47.55,32.13 | IC1.14 88.93,27.86 v84.82,31.98
  Bottom 0.152: v59.97,33.88 59.21,33.88 57.08,31.75 v54.26,31.75 | v26.83,50.87 28.73,52.78 29.49,52.78 X1.22 | v18.29,50.49 18.29,39.67 19.82,38.15 19.82,36.93 20.5,36.24 25.07,36.24 25.61,36.78 28.35,36.78 v35.29,29.84 | v38.94,29.84 38.94,32.89 40.01,33.96 40.01,34.19 40.39,34.57 45.11,34.57 v47.55,32.13 | v84.82,31.98 84.82,34.64 v82.91,36.55
IO4_6  (via drill 0.38)
  Top 0.152: v59.67,32.97 59.97,33.27 65.31,33.27 IC5.23 | v48.77,28.47 47.78,27.48 46.03,27.48 45.95,27.56 IC2.17 45.88,27.63 45.27,28.24 v44.43,28.24 | v31.4,52.32 31.4,50.49 32.01,49.88 32.01,38.91 31.4,38.3 31.4,37.54 32.31,36.63 32.31,35.79 35.51,32.59 v35.74,32.59 | v87.79,24.05 IC1.17 | v87.79,26.87 87.79,27.18 v82.99,31.98 | v73.69,36.55 v77.27,36.55
  Bottom 0.152: v48.77,28.47 55.17,28.47 v59.67,32.97 59.9,32.97 61.42,34.49 71.63,34.49 v73.69,36.55 | v31.4,52.32 29.57,52.32 X1.23 | v35.74,32.59 35.74,32.21 39.4,28.55 44.12,28.55 v44.43,28.24 | v87.79,26.87 v87.79,24.05 | v82.99,31.98 78.41,36.55 v77.27,36.55
IO4_7  (via drill 0.38)
  Top 0.152: v61.04,32.66 65.31,32.66 IC5.24 | v48.16,27.02 46.64,27.02 IC2.18 | v28.05,46 28.05,38.68 v30.79,35.94 | v83.82,31.98 83.82,31.67 88.17,27.33 90.38,27.33 90.76,26.95 90.76,23.67 89.92,22.83 89.39,22.83 IC1.18 | v80.47,35.33 75.06,35.33 v74.22,34.49
  Bottom 0.152: v28.05,46 28.05,51.03 28.81,51.79 29.49,51.79 X1.24 | v30.79,35.94 31.09,35.94 39.7,27.33 45.95,27.33 47.32,28.7 47.78,28.7 48.16,28.32 v48.16,27.02 55.4,27.02 v61.04,32.66 62.56,34.19 71.78,34.19 72.09,34.49 v74.22,34.49 | v80.47,35.33 v83.82,31.98
LADC  (via drill 0.38)
  Top 0.152: v74.68,28.17 74.68,28.78 73.46,30 73.08,30 IC5.11 | v66.76,22.99 66.76,19.25 63.86,16.36 63.86,10.79 60.66,7.59 IC6.1 60.58,7.59 60.43,7.75 58.22,7.75 R29.2
  Bottom 0.152: v74.68,28.17 71.94,28.17 v66.76,22.99
LCLOCK
  Top 0.152: X2.3 76.2,13.38 88.09,25.27 89.31,25.27 IC1.16
LCLR
  Top 0.152: IC1.19 89.31,21.46 88.24,21.46 77.04,10.26 77.04,8.96 X2.4
LD_/C  (via drill 0.38)
  Top 0.152: v55.25,29.39 IC5.29 | v42.45,29.23 41.23,30.45 35.29,30.45 v26.29,39.44 | v18.9,54.99 18.9,59.1 17.91,60.1 v17.91,64.67 | v30.79,59.26 30.79,60.55 31.32,61.09 31.32,61.54 28.43,64.44 v20.5,64.44
  Bottom 0.152: v55.25,29.39 48.92,29.39 48.77,29.23 v42.45,29.23 | v26.29,39.44 23.63,39.44 18.9,44.17 v18.9,54.99 | v17.91,64.67 17.91,64.97 18.6,65.66 R47.1 18.67,65.66 19.89,64.44 v20.5,64.44 | v30.79,59.26 30.71,59.33 29.57,59.33 X1.9
LDIN
  Top 0.152: IC1.15 89.31,26.57 88.85,26.57 75.44,13.16 75.44,8.96 X2.2
LEDK1
  Bottom 0.152: R37.2 22.71,53.47 22.71,51.18 23.86,50.04 23.86,49.43 27.44,45.85 27.44,45.77 27.82,45.39 29.49,45.39 X1.37
LEDK2  (via drill 0.38)
  Top 0.152: v24.46,47.98 13.8,47.98 12.2,46.38 12.2,45.39 12.88,44.7 12.88,44.02 R38.2
  Bottom 0.152: v24.46,47.98 24.77,47.98 27.89,44.86 29.49,44.86 X1.38
LEDK3
  Bottom 0.152: R39.2 29.42,44.25 29.49,44.32 X1.39
LEDK4
  Bottom 0.152: R40.2 24.54,41.73 26.75,41.73 28.81,43.79 29.49,43.79 X1.40
LHVTRIG  (via drill 0.38)
  Top 0.152: v67.82,28.78 65.38,28.78 IC5.30 | v94.42,26.49 94.87,26.03 101.81,26.03 105.01,29.23 109.66,29.23 110.49,28.4 R13.1
  Bottom 0.152: v67.82,28.78 71.63,28.78 71.94,29.08 90,29.08 92.59,26.49 v94.42,26.49
LLED  (via drill 0.38)
  Top 0.152: R44.1 17.07,43.94 16.92,43.79 16.92,41.5 R42.1 17,41.5 17.53,41.5 18.37,40.66 19.89,40.66 20.65,41.43 R43.1 20.73,41.43 22.64,39.52 R41.1 22.71,39.52 22.71,39.29 v25.84,36.17 | v71.86,31.37 73,31.37 IC5.13
  Bottom 0.152: v71.86,31.37 67.14,31.37 61.04,25.27 61.04,24.05 55.94,18.95 44.51,18.95 27.28,36.17 v25.84,36.17
LOPA  (via drill 0.38)
  Top 0.152: v99.98,20.09 98.84,18.95 R20.1 | v113.77,28.01 113.77,28.24 114.53,29.01 H1.3 | v64.24,5 IC6.3
  Bottom 0.152: v113.77,28.01 106.3,28.01 99.98,21.69 v99.98,20.09 99.98,16.05 94.04,10.11 75.98,10.11 70.87,5 v64.24,5
LRD  (via drill 0.38)
  Top 0.152: v69.65,29.39 IC5.10 | v55.25,27.71 v64.32,27.71 | v48.09,30.15 v50.53,27.71 | v40.62,33.96 40.24,33.96 39.1,35.1 33.91,35.1 32.92,36.09 32.92,55.98 v31.55,57.35
  Bottom 0.152: v69.65,29.39 65.99,29.39 v64.32,27.71 | v50.53,27.71 v55.25,27.71 | v48.09,30.15 44.43,30.15 v40.62,33.96 | v31.55,57.35 30.64,58.27 29.57,58.27 X1.11 29.49,58.27 28.81,58.27 27.13,56.59 22.79,56.59 20.2,59.18 18.67,59.18 R50.1
LRESET  (via drill 0.38)
  Top 0.152: v28.05,65.05 20.27,65.05 19.13,63.91 19.13,59.79 30.56,48.36 30.56,37.92 32.01,36.47 32.01,35.48 35.51,31.98 43.21,31.98 44.51,33.27 53.65,33.27 54.26,33.88 57.38,33.88 59.9,31.37 65.31,31.37 IC5.26
  Bottom 0.152: v28.05,65.05 29.19,65.05 31.32,62.91 31.32,61.09 30.64,60.4 29.57,60.4 X1.7
LTS+  (via drill 0.38)
  Top 0.152: v95.94,12.85 98.68,12.85 R12.2 | v93.81,10.72 92.21,10.72 92.05,10.57 X5.1 91.98,10.57 84.59,10.57 X5.4
  Bottom 0.152: v93.81,10.72 v95.94,12.85 95.94,18.11 106.46,28.62 117.35,28.62 122.61,23.37 122.61,18.87 121.7,17.96 121.7,9.5 F1.P$4
LTS-  (via drill 0.38)
  Top 0.152: X5.3 84.59,1.73 91.98,1.73 X5.2 92.05,1.73 92.44,2.11 92.44,8.13 94.42,10.11 94.42,12.17 96.85,14.6 98.68,14.6 R12.1 98.68,14.68 100.59,16.58 100.59,24.36 105.16,28.93 106.23,28.93 108.59,26.57 v108.97,26.57
  Bottom 0.152: v108.97,26.57 118.95,26.57 121.62,23.9 121.62,19.63 F1.P$3
LVSEL
  Top 0.152: IC5.14 73.08,32.05 78.03,32.05 78.57,32.59 88.4,32.59 89.31,31.67 IC1.11
LWR  (via drill 0.38)
  Top 0.152: v70.95,25.5 70.95,27.18 72.47,28.7 73,28.7 IC5.9 | v70.95,20.24 70.95,15.37 71.48,14.83 71.48,12.39 69.35,10.26 v66.6,10.26
  Bottom 0.152: v70.95,20.24 v70.95,25.5 | v66.6,10.26 47.32,10.26 22.79,34.8 18.29,34.8 16.39,36.7 15.4,36.7 4.81,47.29 4.81,51.26 11.97,58.42 17.53,58.42 17.84,58.72 17.84,60.63 18.6,61.39 R49.1 18.67,61.39 21.72,64.44 25.99,64.44 28.27,62.15 28.27,59.41 28.81,58.88 29.49,58.88 X1.10
N$1
  Top 0.152: R1.1 97.54,50.34 97.54,48.36 96.47,47.29 96.47,43.1 94.57,41.2 94.57,35.1 90.45,30.99 88.24,30.99 88.02,30.76 88.02,30 88.32,29.69 91.06,29.69 93.2,27.56 93.2,23.9 95.56,21.54 96.02,21.54 IC1.2
N$2
  Top 0.152: R2.1 96.25,25.12 96.09,25.27 IC1.5
N$3
  Top 0.152: R3.1 99.29,29.92 99.29,29.39 96.55,26.64 96.09,26.64 IC1.6
N$4
  Top 0.152: R4.1 101.58,33.43 101.58,32.51 99.75,30.68 96.32,30.68 96.09,30.45 IC1.9
N$5
  Top 0.152: R5.1 111.49,44.86 110.27,44.86 109.43,45.69 108.44,45.69 107.68,44.93 107.68,44.47 106.76,43.56 102.72,43.56 101.96,42.8 101.96,39.98 92.44,30.45 89.39,30.45 IC1.12
N$6
  Top 0.152: T8.1 95.94,65.2 94.64,63.91 94.57,63.91 94.34,63.68 94.34,62.46 100.21,56.59 106.53,56.59 107.9,57.96 L3.2 107.98,58.04 110.42,60.48 112.32,60.48 SG1.-
N$7
  Top 0.152: T4.3 108.89,45.01 107.6,43.71 107.52,43.71 105.54,41.73 105.54,39.14 101.66,35.25 R4.2
N$8
  Top 0.152: T5.3 113.47,41.2 111.56,43.1 R5.2
N$9
  Top 0.152: 105.58,26.83 102.65,23.9 102.65,19.63 F1.P$1 | 105.58,26.83 105.62,26.87 105.62,28.32 D2.A | 105.58,26.83 105.62,26.8 107.9,26.8 108.74,25.96 116.51,25.96 121.85,31.29 H1.4
N$10
  Top 0.152: R7.1 97.46,54.15 T1.1
N$11
  Top 0.152: T2.1 110.88,41.2 111.56,40.51 117.05,40.51 120.32,43.79 120.32,45.31 121.39,46.38 121.7,46.38 121.85,46.53 121.85,49.2 121.09,49.96 R8.1
N$12
  Top 0.152: T3.1 123.22,54.76 121.09,52.63 R9.1
N$13
  Top 0.152: T1.3 99.45,50.49 99.29,50.34 R1.2
N$14
  Top 0.152: T2.3 108.21,39.14 108.21,36.02 99.06,26.87 R2.2
N$15  (via drill 0.38)
  Top 0.152: v114.46,47.14 118.57,47.14 119.18,47.75 119.18,52.32 122.76,55.9 122.84,55.9 124.13,57.2 T3.3 | v107.37,40.05 107.37,39.52 102.11,34.26 100.97,34.26 99.37,32.66 99.37,31.67 R3.2
  Bottom 0.152: v107.37,40.05 v114.46,47.14
N$16
  Top 0.152: T4.1 107.98,43.03 109.96,43.03 111.03,44.09 112.7,44.09 115.45,46.84 120.71,46.84 121.01,47.14 R10.1
N$17
  Top 0.152: 103.79,54.15 103.79,50.34 C1.2 | 122.76,44.63 122.76,47.14 R10.2 122.76,47.22 122.76,49.96 | 122.76,49.96 122.76,52.63 R9.2 122.84,52.63 124.82,54.61 124.82,57.73 124.67,57.89 121.77,57.89 119.87,55.98 115.07,55.98 113.24,54.15 103.79,54.15 | 122.76,49.96 R8.2 | IC7.7 121.92,43.79 122.76,44.63 | 122.76,44.63 R11.2 | 103.79,54.15 R7.2
N$18  (via drill 0.38)
  Top 0.152: 101.96,50.34 101.96,46.53 C5.1 | 121.96,39.71 123.68,38 124.52,38 125.05,37.46 125.05,35.1 124.9,34.95 121.54,34.95 120.71,35.79 120.71,36.24 IC7.1 120.63,36.32 118.95,36.32 C6.1 118.88,36.32 118.88,36.17 113.16,30.45 113.16,27.86 112.86,27.56 109.96,27.56 109.2,28.32 108.59,28.32 | 121.96,39.71 121.39,40.28 121.39,42.57 121.09,42.87 121.09,44.63 R11.1 | 101.96,50.34 101.96,52.7 102.95,53.69 102.95,54.76 104.47,56.29 119.71,56.29 121.62,58.19 124.82,58.19 125.12,57.89 125.12,45.24 122.46,42.57 122.46,40.21 121.96,39.71 | 101.96,50.34 C1.1 | 108.59,28.32 108.21,28.32 D2.C | 108.59,28.32 v108.59,27.41
  Bottom 0.152: v108.59,27.41 106.15,27.41 101.66,22.91 101.66,18.87 102.57,17.96 102.57,9.5 F1.P$2
N$19
  Top 0.152: 8.81,28.28 5.8,31.29 H2.4 | 8.81,28.28 8.84,28.24 13.95,28.24 14.79,29.08 15.09,29.08 D1.A | 8.81,28.28 5.11,24.59 5.11,19.86 F2.P$1
N$20  (via drill 0.38)
  Top 0.152: v8.62,42.65 8.62,45.46 R15.1 | v15.78,35.71 15.78,35.41 29.57,21.61 36.43,21.61 39.1,18.95 44.2,18.95 v45.57,20.32 | v50.14,23.06 50.14,23.75 51.44,25.04 52.58,25.04 IC2.2
  Bottom 0.152: v8.62,42.65 8.84,42.65 v15.78,35.71 | v45.57,20.32 47.4,20.32 v50.14,23.06
N$21
  Top 0.152: R13.2 112.25,28.4 112.25,31.22 114.53,33.5 H1.1
N$22
  Top 0.152: T8.3 95.03,63.22 95.79,63.22 98,65.43 100.06,65.43 R14.2
N$24
  Top 0.152: R16.1 12.96,50.34 12.96,50.11 13.8,49.27 24.62,49.27 25,49.66 27.67,49.66 30.26,47.06 30.26,37.77 31.7,36.32 31.7,35.33 35.36,31.67 39.7,31.67 40.62,30.76 48.47,30.76 50.3,28.93 52.58,28.93 IC2.5
N$25  (via drill 0.38)
  Top 0.152: v10.22,49.88 8.54,49.88 R17.1 | v14.03,49.88 24.77,49.88 25.15,50.27 v26.22,50.27 | v27.44,49.05 27.44,47.45 29.95,44.93 29.95,37.62 31.4,36.17 31.4,35.18 35.51,31.06 v37.72,31.06 | v39.02,33.81 39.93,33.81 40.54,33.2 v42.22,33.2 | v49.15,30.91 51.36,30.91 52.13,30.15 IC2.6
  Bottom 0.152: v14.03,49.88 v10.22,49.88 | v27.44,49.05 v26.22,50.27 | v37.72,31.06 37.72,32.51 v39.02,33.81 | v42.22,33.2 42.22,32.82 44.12,30.91 v49.15,30.91
N$26  (via drill 0.38)
  Top 0.152: v19.51,58.34 19.51,58.95 18.83,59.64 18.83,64.06 20.43,65.66 28.27,65.66 32.47,61.47 v32.47,58.11 | v32.31,53.24 32.31,52.7 32.62,52.4 32.62,38.23 v32.31,37.92 | v50.75,34.49 51.13,34.49 51.67,33.96 IC2.9
  Bottom 0.152: v19.51,58.34 18.83,57.66 18.83,57.12 R18.1 | v32.47,58.11 33.08,57.5 33.08,54 v32.31,53.24 | v32.31,37.92 32.31,37.16 34.6,34.87 50.37,34.87 v50.75,34.49
N$27  (via drill 0.38)
  Top 0.152: v12.88,63.83 12.88,65.05 R19.1 | v23.02,33.35 23.4,33.35 31.55,25.2 40.7,25.2 42.37,23.52 42.83,23.52 43.21,23.9 43.21,27.48 v41.53,29.16 | v41.15,32.59 43.36,32.59 44.73,33.96 IC2.12
  Bottom 0.152: v12.88,63.83 12.88,59.79 4.5,51.41 4.5,44.47 15.63,33.35 v23.02,33.35 | v41.53,29.16 40.85,29.16 40.39,29.62 40.39,30.07 41.46,31.14 41.46,32.28 v41.15,32.59
N$28  (via drill 0.38)
  Top 0.152: v24.16,47.14 18.6,47.14 v17.68,46.23 | v16.54,45.08 15.47,44.02 R44.2
  Bottom 0.152: v24.16,47.14 24.46,46.84 24.46,46.15 T13.3 | v16.54,45.08 v17.68,46.23
N$29
  Top 0.152: T6.3 10.9,45.92 9.61,45.92 9.22,46.3 7.7,46.3 6.94,45.54 R15.2
N$30
  Top 0.152: T7.3 13.19,53.85 13.03,53.85 11.28,52.09 11.28,50.34 R16.2
N$31
  Top 0.152: T9.3 8.39,55.98 11.21,55.98 11.59,56.36 12.58,56.36 12.73,56.21 12.73,54.61 11.89,53.77 11.89,53.31 9.22,50.65 7.55,50.65 6.79,49.88 R17.2
N$32  (via drill 0.38)
  Top 0.152: v16.01,57.66 13.11,57.66 T10.3
  Bottom 0.152: v16.01,57.66 16.46,57.66 17,57.12 R18.2
N$33
  Top 0.152: T11.3 13.03,62.84 11.28,64.59 11.28,65.05 R19.2
N$35
  Top 0.152: T6.1 11.89,47.9 11.89,45.62 11.05,44.78 10.6,44.78 10.29,44.47 10.29,38.99 10.37,38.91 R22.1
N$36
  Top 0.152: T7.1 12.2,51.87 12.2,51.03 11.97,50.8 11.97,49.66 9.91,47.6 8.39,47.6 R23.1
N$37
  Top 0.152: T9.1 6.41,56.89 6.41,56.06 7.55,54.91 7.55,52.63 6.79,51.87 R24.1
N$38
  Top 0.152: T10.1 9.91,55.68 8.54,54.3 R25.1
N$39
  Top 0.152: 6.37,50.84 6.56,51.03 7.62,51.03 8.46,51.87 R24.2 | 6.37,50.84 6.02,50.49 6.02,49.2 6.63,48.59 6.63,47.6 R23.2 6.63,47.52 6.63,46.68 5.49,45.54 5.49,43.03 4.5,42.04 4.5,41.58 IC8.7 4.5,41.5 4.5,40.97 6.56,38.91 R22.2 9.53,38.07 14.18,38.07 | 6.37,50.84 6.02,51.18 6.02,52.55 6.71,53.24 6.71,54.23 R25.2 | 14.18,38.07 14.18,36.85 13.72,36.4 C2.2 | 14.18,38.07 14.18,38.91 R26.2
N$40  (via drill 0.38)
  Top 0.152: 14.94,35.33 12.81,35.33 11.82,36.32 C2.1 11.74,36.32 10.37,34.95 4.04,34.95 3.62,35.37 | 14.94,35.33 15.32,35.33 16.69,33.96 16.69,31.44 17.61,30.53 17.61,29.16 D1.C 17.68,29.08 18.9,29.08 26.48,21.5 | R26.1 12.81,38.91 13.64,39.75 14.79,39.75 14.94,39.6 14.94,35.33 | 26.48,21.5 28.58,19.4 30.1,19.4 C8.1 | C7.1 29.04,24.05 v28.5,23.52 | v26.52,21.54 26.48,21.5 | 3.62,35.37 3.2,35.79 3.2,36.24 IC8.1 | 3.62,35.37 2.37,34.11 2.37,20.85 5.03,18.19 5.03,9.73 F2.P$2
  Bottom 0.152: v26.52,21.54 v28.5,23.52
N$41
  Bottom 0.152: T12.1 23.55,52.02 23.55,52.7 24.31,53.47 R37.1
N$42
  Top 0.152: R21.2 15.85,31.9 13.03,29.08 H2.1
N$43
  Top 0.152: T15.1 11.89,42.65 11.89,43.33 11.28,43.94 R38.1
N$44  (via drill 0.38)
  Top 0.152: v21.95,43.25 21.95,44.25 20.96,45.24 20.05,45.24 T14.1
  Bottom 0.152: v21.95,43.25 21.95,43.48 22.71,44.25 R39.1
N$45
  Top 0.152: T5.1 113.09,39.14 113.77,39.14 115.22,37.69 123.6,37.69 124.44,36.85 124.44,36.32 IC7.4
N$46
  Bottom 0.152: T13.1 23.55,48.13 23.55,42.49 22.79,41.73 R40.1
N$47
  Top 0.152: T11.1 12.04,60.7 8.92,60.7 2.6,54.38 2.6,40.36 5.26,37.69 6.1,37.69 6.94,36.85 6.94,36.32 IC8.4
N$48
  Top 0.152: T14.3 19.05,43.18 19.05,41.58 18.98,41.5 R43.2
N$49  (via drill 0.38)
  Top 0.152: v25.15,48.97 25.15,40.36 24.39,39.6 R41.2
  Bottom 0.152: v25.15,48.97 24.54,49.58 24.54,49.96 T12.3
N$50
  Top 0.152: T15.3 10.98,40.59 11.74,40.59 12.58,41.43 15.09,41.43 R42.2
N$52
  Top 0.152: R31.1 68.58,5 | 68.58,5 R32.2 | IC6.6 68.58,5
N$54
  Top 0.152: R30.2 58.22,4.01 58.22,5.99 R29.1 58.3,5.99 60.35,5.99 60.58,6.22 IC6.2
RADC
  Top 0.152: IC5.27 66.76,30.68 69.19,28.24 69.19,20.78 66.45,18.03 66.45,12.01 64.47,10.03 64.47,7.14 65.31,6.3 65.84,6.3 IC6.7 65.92,6.3 66.37,6.3 67.82,7.75 68.58,7.75 R31.2
RCLOCK  (via drill 0.38)
  Top 0.152: v47.55,28.09 46.79,28.85 45.95,28.85 IC2.16 | v47.55,24.05 47.55,19.63 49.23,17.96 49.23,12.39 50.91,10.72 50.91,8.96 X4.3
  Bottom 0.152: v47.55,24.05 v47.55,28.09
RCLR
  Top 0.152: IC2.19 45.95,25.04 47.4,25.04 49.53,22.91 49.53,12.55 51.67,10.41 51.67,8.96 X4.4
RDIN
  Top 0.152: IC2.15 45.5,30.15 43.74,28.4 43.74,22.99 48.92,17.8 48.92,12.24 50.07,11.1 50.07,8.96 X4.2
RHVTRIG  (via drill 0.38)
  Top 0.152: v69.19,9.65 78.95,19.4 78.95,23.37 78.72,23.6 77.2,23.6 75.98,24.81 73.08,24.81 IC5.3 | v27.74,21.84 17.68,31.9 R21.1
  Bottom 0.152: v69.19,9.65 39.93,9.65 v27.74,21.84
ROPA  (via drill 0.38)
  Top 0.152: v16.62,35.63 18.83,37.84 21.72,37.84 27.36,32.21 30.48,32.21 R28.1 v31.55,31.06 | v15.4,34.42 13.95,34.42 13.11,33.58 H2.3 | v44.58,18.03 44.58,7.67 47.93,4.32 53.5,4.32 53.57,4.39 56.47,4.39 56.62,4.24 56.62,4.09 57.54,3.17 58.83,3.17 58.98,3.33 58.98,3.86 59.44,4.32 61.8,4.32 62.34,3.78 65.84,3.78 IC6.5
  Bottom 0.152: v15.4,34.42 v16.62,35.63 | v31.55,31.06 v44.58,18.03
RTS+
  Top 0.152: F2.P$4 28.05,13.61 28.05,13.92 R27.2 28.05,13.54 32.24,13.54 35.21,10.57 X3.4 35.29,10.57 42.68,10.57 X3.1
RTS-
  Top 0.152: F2.P$3 24.16,19.86 28.05,15.98 28.05,15.67 R27.1 28.12,15.59 35.89,15.59 39.93,11.56 44.12,11.56 44.28,11.4 44.28,3.4 42.68,1.8 X3.2 42.68,1.73 35.29,1.73 X3.3
RVSEL
  Top 0.152: IC5.25 65.31,32.05 59.67,32.05 57.15,34.57 51.52,34.57 50.91,35.18 45.95,35.18 IC2.11
SPKR  (via drill 0.38)
  Top 0.152: v94.26,45.62 94.26,40.51 89.69,35.94 82.22,35.94 80.01,38.15 72.09,38.15 69.27,35.33 69.27,33.12 71.63,30.76 73,30.76 IC5.12 | v97.85,63.07 98.91,63.07 100.51,64.67 101.05,64.67 101.81,65.43 R14.1
  Bottom 0.152: v94.26,45.62 94.26,47.52 97.85,51.1 v97.85,63.07
TCK
  Top 0.152: IC5.35 65.38,25.42 65.84,25.42 67.37,23.9 67.37,19.4 65.46,17.5 65.46,13.69 SV1.3
  Bottom 0.152: SV1.3 70.95,19.18 88.7,19.18 106.91,37.39 106.91,37.54 S5.4
TDI
  Top 0.152: IC5.37 65.38,24.13 65.84,24.13 66.15,23.82 66.15,19.48 60.35,13.69 SV1.5
  Bottom 0.152: S7.4 50.53,16.97 51.44,17.88 56.09,17.88 SV1.5
TDO
  Top 0.152: SV1.6 65.31,21.16 65.31,23.52 IC5.38
TEST
  Top 0.152: IC5.1 73,23.52 73,23.14 70.34,20.47 70.34,13.84 70.49,13.69 SV1.1
TMS
  Top 0.152: IC5.36 65.31,24.81 64.93,24.81 64.39,24.28 64.39,22.15 57.69,15.44 57.38,15.44 56.77,14.83 56.77,12.47 57.38,11.86 61.12,11.86 62.87,13.61 SV1.4
  Bottom 0.152: S6.4 16.16,38.15 17,38.15 20.05,35.1 23.86,35.1 47.1,11.86 61.12,11.86 62.87,13.61 SV1.4
VBAT  (via drill 0.38)
  Top 0.152: v66.6,30 65.38,30 IC5.28 | v95.79,35.48 96.32,35.48 101.12,40.28 101.12,42.72 R46.2 | v95.79,32.97 103.26,40.44 103.26,42.72 R45.1
  Bottom 0.152: v66.6,30 77.42,30 77.58,29.84 90.99,29.84 92.74,31.6 92.74,32.43 94.53,34.23 | v95.79,35.48 94.53,34.23 | 94.53,34.23 v95.79,32.97
VCC  (via drill 0.38)
  Top 0.305: v49.38,10.95 49.38,8.96 X4.1 | v73.84,9.73 74.6,8.96 X2.1 | 108.06,61.92 108.06,60.55 107.98,60.48 L3.1 | 108.06,61.92 108.06,64.29 C10.1 | v118.5,46.23 118.5,43.71 IC3.3 | 108.06,61.92 117.43,61.92 118.8,60.55 SG1.+
  Bottom 0.305: v49.38,10.95 72.62,10.95 v73.84,9.73 73.92,9.8 74.38,9.8 81.84,17.27 82.45,17.27 83.98,18.79 90.53,18.79 110.49,38.76 110.49,39.52 117.12,46.15 118.42,46.15 v118.5,46.23 118.5,60.17 SG1.+
XIN
  Top 0.152: IC5.6 73.08,26.8 76.59,26.8 Q3.2 78.11,28.4 79.02,29.31 79.02,31.29 C12.1
XOUT
  Top 0.152: 78.11,26.57 77.73,26.19 73.08,26.19 IC5.5 | 78.11,26.57 80.62,26.57 C11.1 | 78.11,26.57 Q3.1

### Text on the board
tDocu: eTapper Main R54
DrillLegend: LAYER-STACK
DrillLegend_01-16: 01-16
DrillLegend_01-20: 01-20